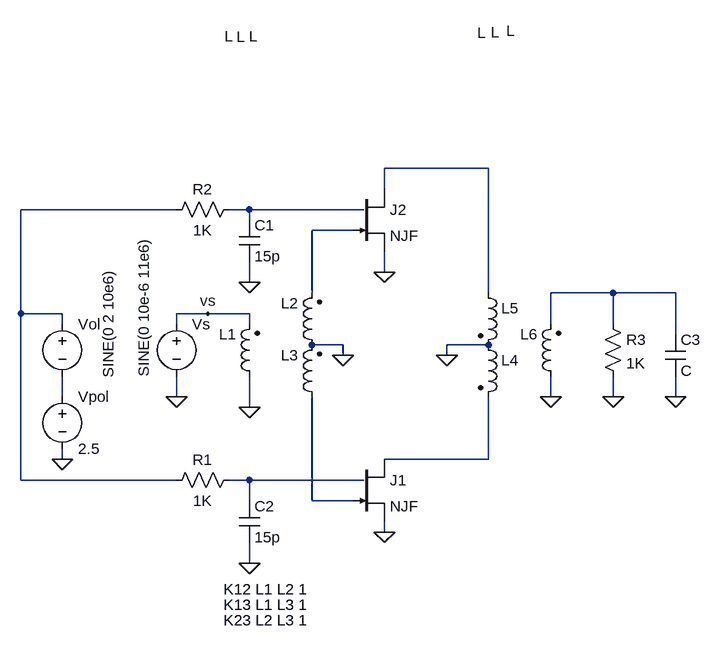
[diagram p0: schematic dual_esquema.asc]
dual_esquema.asc, the LTspice schematic file:
Version 4
SHEET 1 880 680
WIRE 416 -96 256 -96
WIRE 256 -64 256 -96
WIRE -64 -32 -304 -32
WIRE 48 -32 16 -32
WIRE 224 -32 48 -32
WIRE 48 -16 48 -32
WIRE 208 0 144 0
WIRE 256 64 256 32
WIRE 48 80 48 48
WIRE 144 96 144 0
WIRE 416 96 416 -96
WIRE 608 96 512 96
WIRE 704 96 608 96
WIRE -304 128 -304 -32
WIRE -240 128 -304 128
WIRE -16 128 -64 128
WIRE 48 128 -16 128
WIRE -240 144 -240 128
WIRE -64 144 -64 128
WIRE 48 144 48 128
WIRE 512 144 512 96
WIRE 608 144 608 96
WIRE 704 160 704 96
WIRE 192 176 144 176
WIRE 416 176 352 176
WIRE 192 192 192 176
WIRE 352 192 352 176
WIRE -240 256 -240 224
WIRE -64 256 -64 224
WIRE 512 256 512 224
WIRE 608 256 608 224
WIRE 704 256 704 224
WIRE 48 272 48 224
WIRE -240 352 -240 336
WIRE 416 352 416 256
WIRE 416 352 256 352
WIRE -304 384 -304 128
WIRE -64 384 -304 384
WIRE 48 384 16 384
WIRE 224 384 48 384
WIRE 48 416 48 384
WIRE 144 416 144 256
WIRE 208 416 144 416
WIRE 256 464 256 448
WIRE 48 512 48 480
FLAG 192 192 0
FLAG 48 272 0
FLAG 256 64 0
FLAG 256 464 0
FLAG 512 256 0
FLAG 608 256 0
FLAG 48 80 0
FLAG 48 512 0
FLAG -16 128 vs
FLAG -240 352 0
FLAG 352 192 0
FLAG -64 256 0
FLAG 704 256 0
SYMBOL ind2 64 240 R180
WINDOW 0 36 80 Left 2
WINDOW 3 41 539 Left 2
SYMATTR InstName L1
SYMATTR Type ind
SYMBOL ind2 160 192 R180
WINDOW 0 36 80 Left 2
WINDOW 3 118 490 Left 2
SYMATTR InstName L2
SYMATTR Type ind
SYMBOL ind2 160 272 R180
WINDOW 0 36 80 Left 2
WINDOW 3 99 571 Left 2
SYMATTR InstName L3
SYMATTR Type ind
SYMBOL njf 208 352 R0
SYMATTR InstName J1
SYMBOL njf 208 -64 R0
SYMATTR InstName J2
SYMBOL cap 32 -16 R0
SYMATTR InstName C1
SYMATTR Value 15p
SYMBOL cap 32 416 R0
SYMATTR InstName C2
SYMATTR Value 15p
SYMBOL res 32 368 R90
WINDOW 0 0 56 VBottom 2
WINDOW 3 32 56 VTop 2
SYMATTR InstName R1
SYMATTR Value 1K
SYMBOL res 32 -48 R90
WINDOW 0 0 56 VBottom 2
WINDOW 3 32 56 VTop 2
SYMATTR InstName R2
SYMATTR Value 1K
SYMBOL ind2 400 160 R0
WINDOW 3 20 -465 Left 2
SYMATTR InstName L4
SYMATTR Type ind
SYMBOL ind2 400 80 R0
WINDOW 3 -1 -384 Left 2
SYMATTR InstName L5
SYMATTR Type ind
SYMBOL ind2 528 240 R180
WINDOW 0 36 80 Left 2
WINDOW 3 71 547 Left 2
SYMATTR InstName L6
SYMATTR Type ind
SYMBOL res 592 128 R0
SYMATTR InstName R3
SYMATTR Value 1K
SYMBOL voltage -240 128 R0
WINDOW 3 71 99 VLeft 2
WINDOW 123 0 0 Left 0
WINDOW 39 0 0 Left 0
SYMATTR InstName Vol
SYMATTR Value SINE(0 2 10e6)
SYMBOL voltage -240 240 R0
WINDOW 123 0 0 Left 0
WINDOW 39 0 0 Left 0
SYMATTR InstName Vpol
SYMATTR Value 2.5
SYMBOL voltage -64 128 R0
WINDOW 3 -51 98 VLeft 2
WINDOW 123 0 0 Left 0
WINDOW 39 0 0 Left 0
SYMATTR InstName Vs
SYMATTR Value SINE(0 10e-6 11e6)
SYMBOL cap 688 160 R0
SYMATTR InstName C3
TEXT 8 552 Left 2 !K12 L1 L2 1
TEXT 8 576 Left 2 !K13 L1 L3 1
TEXT 8 600 Left 2 !K23 L2 L3 1

The netlist it stands for:
* dual_esquema.asc
L1 0 vs L
L2 0 N004 L
L3 N009 0 L
J1 N007 N009 0 NJF
J2 N001 N004 0 NJF
C1 N003 0 15p
C2 N008 0 15p
R1 N008 N002 1K
R2 N003 N002 1K
L4 0 N007 L
L5 N001 0 L
L6 0 N005 L
R3 N005 0 1K
Vol N002 N006 SINE(0 2 10e6)
Vpol N006 0 2.5
Vs vs 0 SINE(0 10e-6 11e6)
C3 N005 0 C
.model NJF NJF
.model PJF PJF
.lib standard.jft
K12 L1 L2 1
K13 L1 L3 1
K23 L2 L3 1
.backanno
.end